# Altium schematic sheet Sheet_1_2023-04-10.schdoc
size 405 x 215 mm
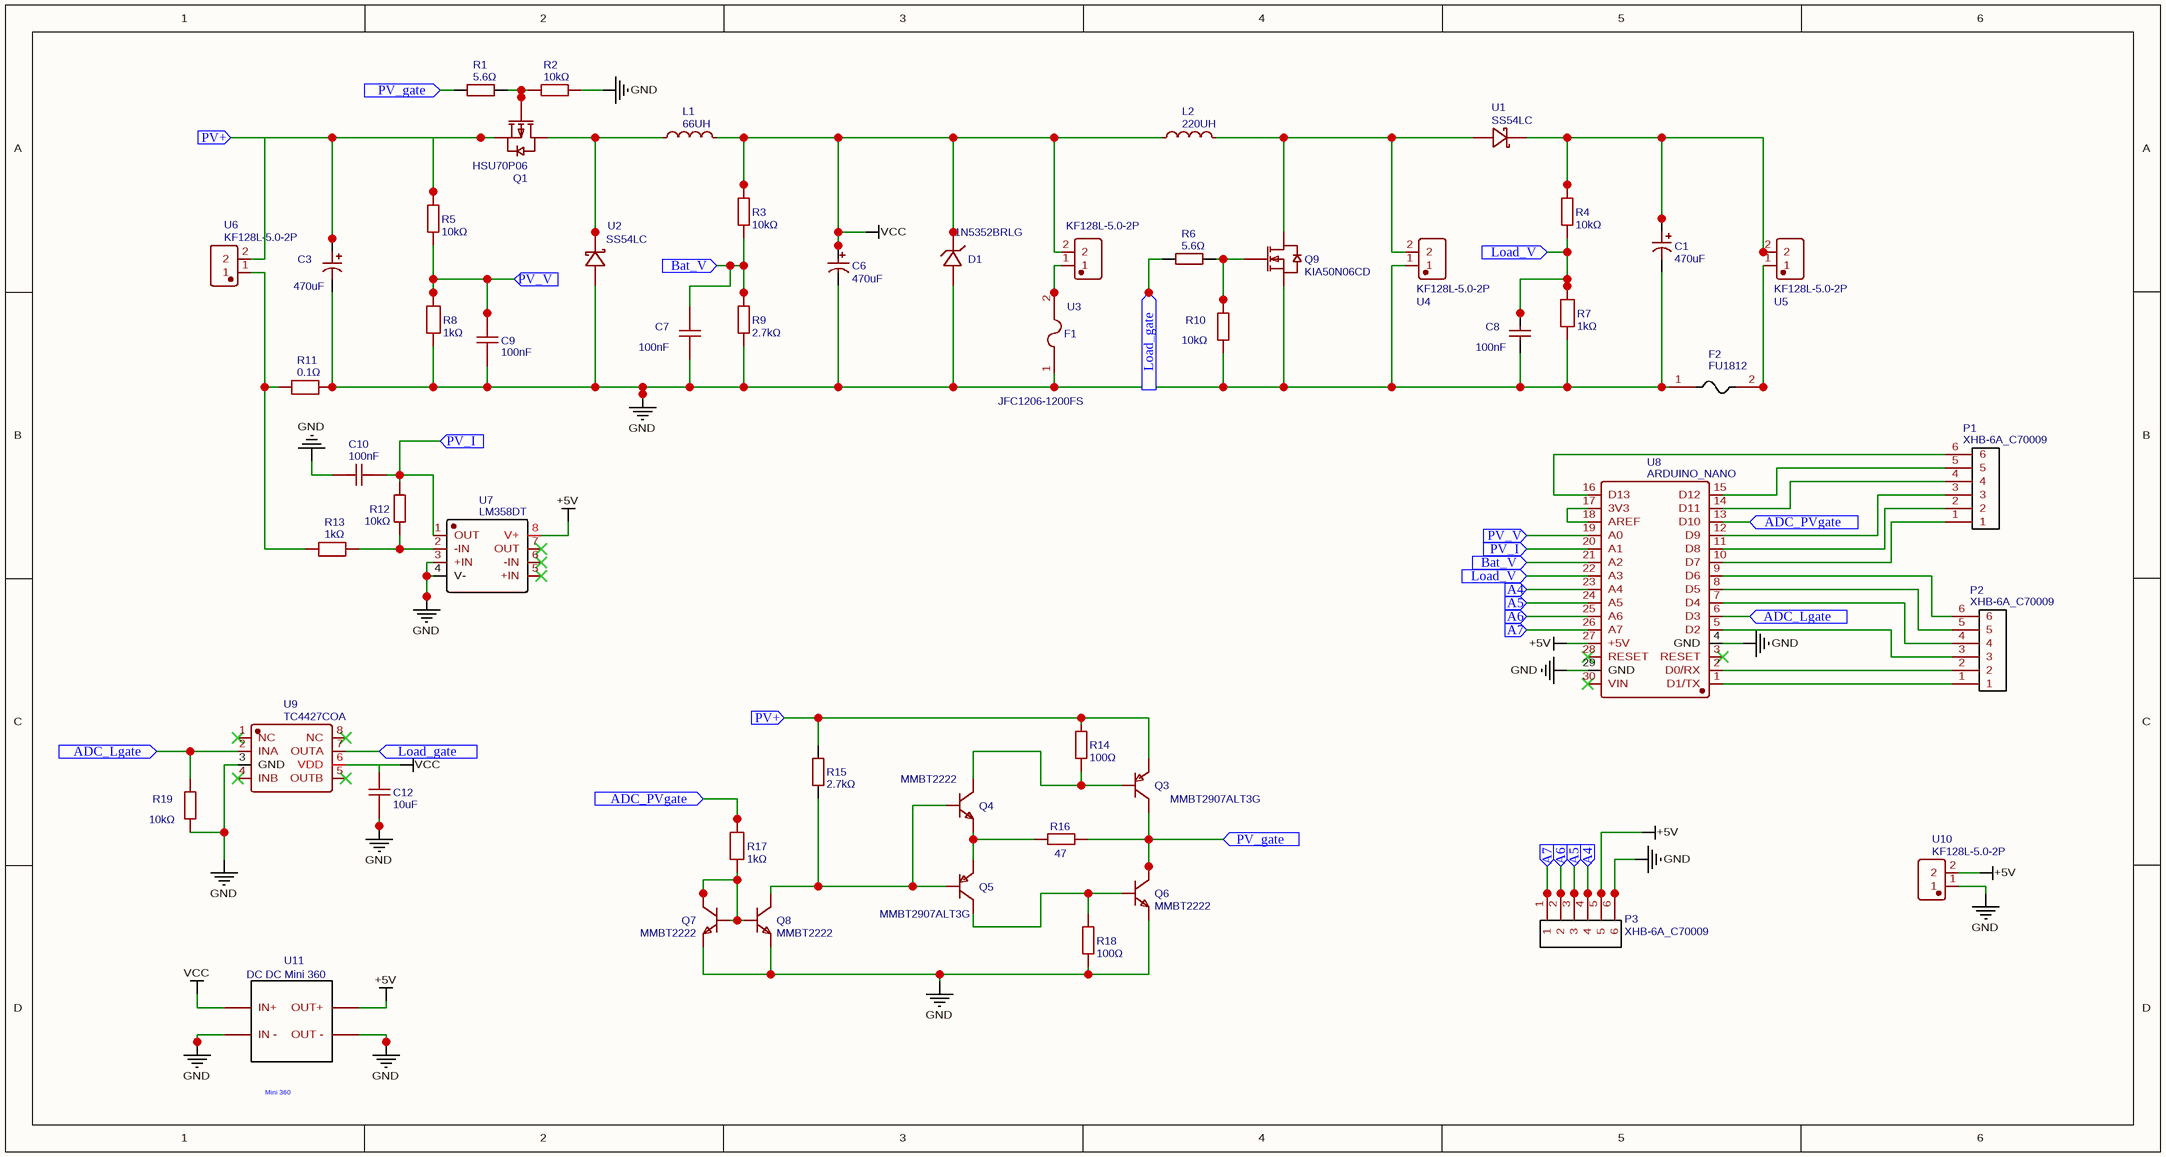
[diagram p0: Sheet_1_2023-04-10.schdoc]

## Parts
C1  470uF  [CAP-TH_BD10.0-P5.00-D0.6-FD]
C3  470uF  [CAP-TH_BD10.0-P5.00-D0.6-FD]
C6  470uF  [CAP-TH_BD10.0-P5.00-D1.0-FD]
C7  100nF  [C0805]
C8  100nF  [C0805]
C9  100nF  [C0805]
C10  100nF  [C0805]
C12  10uF  [C1206]
D1  1N5352BRLG  [DO-27_BD5.2-L8.9-P12.90-D1.5-RD]
F1  JFC1206-1200FS  [F1206]
F2  FU1812  [F1812]
L1  66UH  [IND-TH_L15.5-W7.2-P6.40-D1.0]
L2  220UH  [IND-TH_L15.5-W7.2-P6.40-D1.0]
P1  XHB-6A_C70009  [CONN-TH_6P_XHB-6A]
P2  XHB-6A_C70009  [CONN-TH_6P_XHB-6A]
P3  XHB-6A_C70009  [CONN-TH_6P_XHB-6A]
Q1  HSU70P06  [TO-252-2_L6.6-W6.1-P4.58-LS9.9-BR]
Q3  MMBT2907ALT3G  [SOT-23-3_L2.9-W1.3-P1.90-LS2.4-BR]
Q4  MMBT2222  [SOT-23-3_L2.9-W1.4-P1.91-LS2.6-BR]
Q5  MMBT2907ALT3G  [SOT-23-3_L2.9-W1.3-P1.90-LS2.4-BR]
Q6  MMBT2222  [SOT-23-3_L2.9-W1.4-P1.91-LS2.6-BR]
Q7  MMBT2222  [SOT-23-3_L2.9-W1.4-P1.91-LS2.6-BR]
Q8  MMBT2222  [SOT-23-3_L2.9-W1.4-P1.91-LS2.6-BR]
Q9  KIA50N06CD  [TO-252-2_L6.6-W5.7-P4.6-LS9.9-BR-CW]
R1  5.6Ω  [R0805]
R2  10kΩ  [R0805]
R3  10kΩ  [R0805]
R4  10kΩ  [R0805]
R5  10kΩ  [R0805]
R6  5.6Ω  [R0805]
R7  1kΩ  [R0805]
R8  1kΩ  [R0805]
R9  2.7kΩ  [R0805]
R10  10kΩ  [R0805]
R11  0.1Ω  [R2512]
R12  10kΩ  [R0805]
R13  1kΩ  [R0805]
R14  100Ω  [R0805]
R15  2.7kΩ  [R0805]
R16  47  [R0805]
R17  1kΩ  [R0805]
R18  100Ω  [R0805]
R19  10kΩ  [R0805]
U1  SS54LC  [DO-214AB_L6.9-W5.9-LS7.9-RD]
U2  SS54LC  [DO-214AB_L6.9-W5.9-LS7.9-RD]
U3  KF128L-5.0-2P  [CONN-TH_P5.00_KF128L-5.0-2P]
U4  KF128L-5.0-2P  [CONN-TH_P5.00_KF128L-5.0-2P]
U5  KF128L-5.0-2P  [CONN-TH_P5.00_KF128L-5.0-2P]
U6  KF128L-5.0-2P  [CONN-TH_P5.00_KF128L-5.0-2P]
U7  LM358DT  [SOIC-8_L5.0-W4.0-P1.27-LS6.0-BL]
U8  ARDUINO_NANO  [COMM-TH_ARDUINO_NANO]
U9  TC4427COA  [SOIC-8_L5.0-W4.0-P1.27-LS6.1-BL]
U10  KF128L-5.0-2P  [CONN-TH_P5.00_KF128L-5.0-2P]
U11  DC DC Mini 360  [DC_DC_MINI360]

## Ports
A4 (in), A5 (in), A6 (in), A7 (in), ADC_Lgate (in), ADC_PVgate (in), Bat_V (in), Load_gate (in), Load_V (in), PV+ (in), PV_gate (in), PV_I (in), PV_V (in)

## Nets
+5V: P3.5 U7.8(V+) U8.27(+5V) U10.2 U11.1(OUT+)
GND: C1.2 C3.2 C6.2 C7.1 C8.1 C9.1 C10.2 C12.1 D1.2(A) F1.1 F2.1 P3.6 Q6.2(E) Q7.2(E) Q8.2(E) Q9.3(S) R2.1 R7.1 R8.1 R9.1 R10.1 R11.2 R18.2 R19.1 U2.2(A) U4.1 U7.3(+IN) U7.4(V-) U8.4(GND) U8.29(GND) U9.3(GND) U10.1 U11.2(OUT_-) U11.4(IN_-)
VCC: C6.1 C12.2 D1.1(K) L1.2 L2.1 R3.2 U3.2 U9.6(VDD) U11.3(IN+)
A4: P3.4 U8.23(A4) ; port A4
A5: P3.3 U8.24(A5) ; port A5
A6: P3.2 U8.25(A6) ; port A6
A7: P3.1 U8.26(A7) ; port A7
ADC_Lgate: R19.2 U8.6(D3) U9.2(INA) ; port ADC_Lgate
ADC_PVgate: R17.2 U8.13(D10) ; port ADC_PVgate
Bat_V: C7.2 R3.1 R9.2 U8.21(A2) ; port Bat_V
Load_gate: R6.1 U9.7(OUTA) ; port Load_gate
Load_V: C8.2 R4.1 R7.2 U8.22(A3) ; port Load_V
PV+: C3.1 Q1.3(S) Q3.2(E) R5.2 R14.1 R15.2 U6.2 ; port PV+
PV_gate: Q3.3(C) Q6.3(C) R1.1 R16.2 ; port PV_gate
PV_I: C10.1 R12.1 U7.1(OUT) U8.20(A1) ; port PV_I
PV_V: C9.2 R5.1 R8.2 U8.19(A0) ; port PV_V
NetC1_1: C1.1 R4.2 U1.1(K) U5.2
NetF1_2: F1.2 U3.1
NetF2_2: F2.2 U5.1
NetL1_1: L1.1 Q1.2(D) U2.1(K)
NetL2_2: L2.2 Q9.2(D) U1.2(A) U4.2
NetP1_1: P1.1 U8.10(D7)
NetP1_2: P1.2 U8.11(D8)
NetP1_3: P1.3 U8.12(D9)
NetP1_4: P1.4 U8.14(D11)
NetP1_5: P1.5 U8.15(D12)
NetP1_6: P1.6 U8.16(D13)
NetP2_1: P2.1 U8.1(D1/TX)
NetP2_2: P2.2 U8.2(D0/RX)
NetP2_3: P2.3 U8.5(D2)
NetP2_4: P2.4 U8.7(D4)
NetP2_5: P2.5 U8.8(D5)
NetP2_6: P2.6 U8.9(D6)
NetQ1_1: Q1.1(G) R1.2 R2.2
NetQ3_1: Q3.1(B) Q4.3(C) R14.2
NetQ4_1: Q4.1(B) Q5.1(B) Q8.3(C) R15.1
NetQ4_2: Q4.2(E) Q5.2(E) R16.1
NetQ5_3: Q5.3(C) Q6.1(B) R18.1
NetQ7_1: Q7.1(B) Q7.3(C) Q8.1(B) R17.1
NetQ9_1: Q9.1(G) R6.2 R10.2
NetR11_1: R11.1 R13.2 U6.1
NetR12_2: R12.2 R13.1 U7.2(-IN)
NetU8_17: U8.17(3V3) U8.18(AREF)

Not connected (* = marked no-connect by the designer): U7 5(+IN)* 6(-IN)* 7(OUT)*; U8 3(RESET)* 28(RESET)* 30(VIN)*; U9 1(NC)* 4(INB)* 5(OUTB)* 8(NC)*

## Notes on the sheet
- (in symbol DC DC Mini 360) Mini 360

## Library data of the parts
C1 C3 = 470uF: BOM_Manufacturer: HRK(鸿瑞凯电子); BOM_Manufacturer Part: 35V470uF CD288; Contributor: LCSC; nameAlias: Capacitance; BOM_Supplier: LCSC; BOM_Supplier Part: C2960252; spicePre: C; spiceSymbolName: 35V470UF CD288
C6 = 470uF: BOM_Manufacturer: CX(承兴); BOM_Manufacturer Part: KM477M025G13RR0VH2FP0; nameAlias: Capacitance; BOM_Supplier: LCSC; BOM_Supplier Part: C44594; BOM_JLCPCB Part Class: Extended Part; spicePre: C; spiceSymbolName: 470uF 25V 10*13
C7 C9 C10 = 100nF: BOM_Manufacturer: HUI JU(汇聚); BOM_Manufacturer Part: NL0805B104M500CPBN; nameAlias: Capacitance; Contributor: LCSC; BOM_Supplier: LCSC; BOM_Supplier Part: C720961; BOM_JLCPCB Part Class: Extended Part; spicePre: C; spiceSymbolName: NL0805B104M500CPBN
C8 = 100nF: BOM_Manufacturer: HEC; BOM_Manufacturer Part: C0805X104K101T; nameAlias: Capacitance; BOM_Supplier: LCSC; BOM_Supplier Part: C105951; BOM_JLCPCB Part Class: Extended Part; spicePre: C; spiceSymbolName: C0805X104K101T
C12 = 10uF: BOM_Manufacturer: Kyocera AVX; BOM_Manufacturer Part: 12066D106MAT4X; nameAlias: Capacitance; Contributor: LCSC; BOM_Supplier: LCSC; BOM_Supplier Part: C2312016; BOM_JLCPCB Part Class: Extended Part; spicePre: C; spiceSymbolName: 12066D106MAT4X
D1 = 1N5352BRLG: BOM_Manufacturer: onsemi(安森美); BOM_Supplier: LCSC; BOM_Manufacturer Part: 1N5352BRLG; BOM_Supplier Part: C9711; BOM_JLCPCB Part Class: Extended Part; spicePre: D; spiceSymbolName: 1N5352BRLG
F1 = JFC1206-1200FS: BOM_Manufacturer: JDTfuse(集电通); Contributor: LCSC; BOM_Supplier: LCSC; BOM_Manufacturer Part: JFC1206-1200FS; BOM_Supplier Part: C136345; BOM_JLCPCB Part Class: Extended Part; spicePre: F; spiceSymbolName: JFC1206-1200FS
F2 = FU1812: BOM_Manufacturer: null; Contributor: lcsc; BOM_Supplier: LCSC; BOM_Supplier Part: C9900015946; BOM_Manufacturer Part: FU1812; BOM_JLCPCB Part Class: Extended Part; spicePre: F; spiceSymbolName: FU1812
L1 = 66UH: BOM_Manufacturer: null; BOM_Manufacturer Part: 47uH/10A; Contributor: lcsc; BOM_Supplier: LCSC; BOM_Supplier Part: C9900026882; link: https://atta.szlcsc.comnull; spicePre: L; spiceSymbolName: 47UH/10A
L2 = 220UH: BOM_Manufacturer: null; BOM_Manufacturer Part: 47uH/10A; Contributor: lcsc; BOM_Supplier: LCSC; BOM_Supplier Part: C9900026882; link: https://atta.szlcsc.comnull; spicePre: L; spiceSymbolName: 47UH/10A
P1-P3 = XHB-6A_C70009: BOM_Manufacturer: BOOMELE(博穆精密); BOM_Manufacturer Part: XHB-6A; BOM_Supplier: LCSC; BOM_Supplier Part: C70009; BOM_JLCPCB Part Class: Extended Part; spicePre: P; spiceSymbolName: XHB-6A_C70009
Q1 = HSU70P06: BOM_Manufacturer: HUASHUO(华朔); Contributor: LCSC; BOM_Supplier: LCSC; BOM_Supplier Part: C2828492; BOM_Manufacturer Part: HSU70P06; BOM_JLCPCB Part Class: Extended Part; spicePre: Q; spiceSymbolName: HSU70P06
Q3 Q5 = MMBT2907ALT3G: BOM_Manufacturer: onsemi(安森美); Contributor: LCSC; BOM_Supplier: LCSC; BOM_Supplier Part: C191231; BOM_Manufacturer Part: MMBT2907ALT3G; spicePre: Q; spiceSymbolName: MMBT2907ALT3G
Q4 Q6-Q8 = MMBT2222: BOM_Manufacturer: YONGYUTAI(永裕泰); Contributor: LCSC; BOM_Supplier: LCSC; BOM_Supplier Part: C2891810; BOM_Manufacturer Part: MMBT2222; BOM_JLCPCB Part Class: Extended Part; spicePre: Q; spiceSymbolName: MMBT2222
Q9 = KIA50N06CD: BOM_Manufacturer: KIA; Contributor: LCSC; BOM_Supplier: LCSC; BOM_Supplier Part: C2931913; BOM_Manufacturer Part: KIA50N06CD; BOM_JLCPCB Part Class: Extended Part; spicePre: Q; spiceSymbolName: KIA50N06CD
R1 R6 = 5.6Ω: BOM_Manufacturer: LIZ(丽智电子); BOM_Manufacturer Part: CR0805J805R6G; nameAlias: Resistance; Resistance (Ohms): 5.6; BOM_Supplier: LCSC; BOM_Supplier Part: C102035; BOM_JLCPCB Part Class: Extended Part; spicePre: R; spiceSymbolName: CR0805J805R6G
R2-R5 R10 R12 R19 = 10kΩ: BOM_Manufacturer: ROHM(罗姆); BOM_Manufacturer Part: MCR10EZPF1002; Resistance (Ohms): 10K; nameAlias: Resistance; Contributor: LCSC; BOM_Supplier: LCSC; BOM_Supplier Part: C253445; BOM_JLCPCB Part Class: Extended Part; spicePre: R; spiceSymbolName: MCR10EZPF1002
R7 R8 R13 R17 = 1kΩ: BOM_Manufacturer: PANASONIC(松下); BOM_Manufacturer Part: ERJP06F1001V; Resistance (Ohms): 1K; nameAlias: Resistance; Contributor: LCSC; BOM_Supplier: LCSC; BOM_Supplier Part: C441981; BOM_JLCPCB Part Class: Extended Part; spicePre: R; spiceSymbolName: ERJP06F1001V
R9 = 2.7kΩ: BOM_Manufacturer: Tyohm(幸亚电阻); BOM_Manufacturer Part: RMC08052.7K5%N; Resistance (Ohms): 2.7K; nameAlias: Resistance; Contributor: LCSC; BOM_Supplier: LCSC; BOM_Supplier Part: C325950; BOM_JLCPCB Part Class: Extended Part; spicePre: R; spiceSymbolName: RMC08052.7K5%N
R11 = 0.1Ω: BOM_Manufacturer: SEI(Stackpole Electronics Inc.); BOM_Manufacturer Part: CSRN2512FTR100; Resistance (Ohms): 0.1; nameAlias: Resistance; Contributor: LCSC; BOM_Supplier: LCSC; BOM_Supplier Part: C346817; BOM_JLCPCB Part Class: Extended Part; spicePre: R; spiceSymbolName: CSRN2512FTR100
R14 R18 = 100Ω: BOM_Manufacturer: RESI(开步睿思）; BOM_Manufacturer Part: AECR0805F100RK9; Resistance (Ohms): 100; nameAlias: Resistance; Contributor: LCSC; BOM_Supplier: LCSC; BOM_Supplier Part: C328380; BOM_JLCPCB Part Class: Extended Part; spicePre: R; spiceSymbolName: AECR0805F100RK9
R15 = 2.7kΩ: BOM_Manufacturer: LIZ(丽智电子); BOM_Manufacturer Part: CR0805F82701G; nameAlias: Resistance; Resistance (Ohms): 2.7K; BOM_Supplier: LCSC; BOM_Supplier Part: C101616; BOM_JLCPCB Part Class: Extended Part; spicePre: R; spiceSymbolName: CR0805F82701G
R16 = 47: BOM_Manufacturer: YAGEO(国巨); BOM_Manufacturer Part: AC0805FR-0747RL; nameAlias: Resistance (Ohms); Contributor: LCSC; Resistance: 47Ω; BOM_Supplier: LCSC; BOM_Supplier Part: C144557; BOM_JLCPCB Part Class: Extended Part; spicePre: R; spiceSymbolName: AC0805FR-0747RL
U1 U2 = SS54LC: BOM_Manufacturer: JUXING(钜兴); Contributor: lcsc; BOM_Supplier: LCSC; BOM_Supplier Part: C3033290; BOM_Manufacturer Part: SS54LC; link: https://atta.szlcsc.com/upload/public/pdf/source/20220610/696DB62591AAF4A9CA4BCF77FF72E08A.pdf; spicePre: U; spiceSymbolName: SS54LC
U3-U6 U10 = KF128L-5.0-2P: BOM_Manufacturer: Cixi Kefa Elec; Contributor: LCSC; BOM_Supplier: LCSC; BOM_Supplier Part: C474938; BOM_Manufacturer Part: KF128L-5.0-2P; BOM_JLCPCB Part Class: Extended Part; spicePre: U; spiceSymbolName: KF128L-5.0-2P
U7 = LM358DT: BOM_Manufacturer: ST(意法半导体); BOM_Supplier: LCSC; BOM_Manufacturer Part: LM358DT; BOM_Supplier Part: C9418; BOM_JLCPCB Part Class: Extended Part; spicePre: U; spiceSymbolName: LM358DT
U8 = ARDUINO_NANO: BOM_Manufacturer: null; Contributor: lcsc; BOM_Supplier: LCSC; BOM_Supplier Part: C9900017879; BOM_Manufacturer Part: ARDUINO_NANO; BOM_JLCPCB Part Class: Extended Part; spicePre: U; spiceSymbolName: ARDUINO_NANO
U9 = TC4427COA: BOM_Manufacturer: MICROCHIP(美国微芯); Contributor: lcsc; BOM_Supplier: LCSC; BOM_Supplier Part: C636890; BOM_Manufacturer Part: TC4427COA; link: https://atta.szlcsc.comnull; BOM_JLCPCB Part Class: Extended Part; spicePre: U; spiceSymbolName: TC4427COA
U11 = DC DC Mini 360: Contributor: stanpak; sourceId: FRLFXR8qI; timeStamp: 1471372851; spicePre: U; spiceSymbolName: DC DC Mini 360